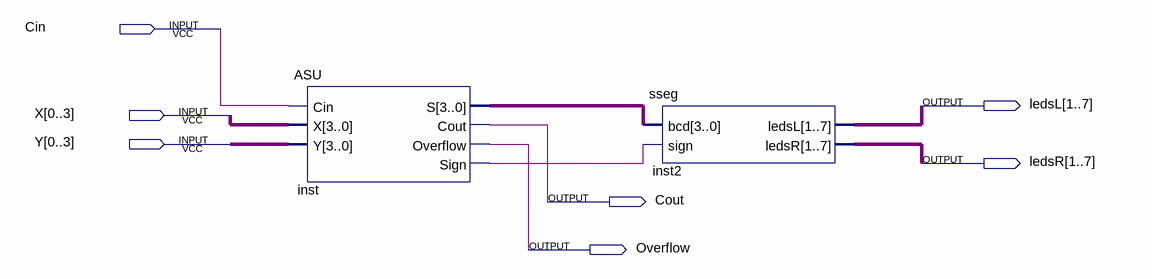
[diagram p0: schematic sheet]
// Quartus schematic CombinedASU1.bdf as structural Verilog: 2 symbols, 7 pins
module CombinedASU1 (
  input  Cin,
  input  [0:3] X,
  input  [0:3] Y,
  output [1:7] ledsL,
  output [1:7] ledsR,
  output Cout,
  output Overflow
);

  wire inst_sign;
  wire [3:0] inst_s;

  ASU inst (.Cin(Cin), .X(X), .Y(Y), .S(inst_s), .Cout(Cout), .Overflow(Overflow), .Sign(inst_sign));
  sseg inst2 (.bcd(inst_s), .sign(inst_sign), .ledsL(ledsL), .ledsR(ledsR));
endmodule
